# EAGLE schematic 7 Key Prototype (EAGLE 9.6.2)
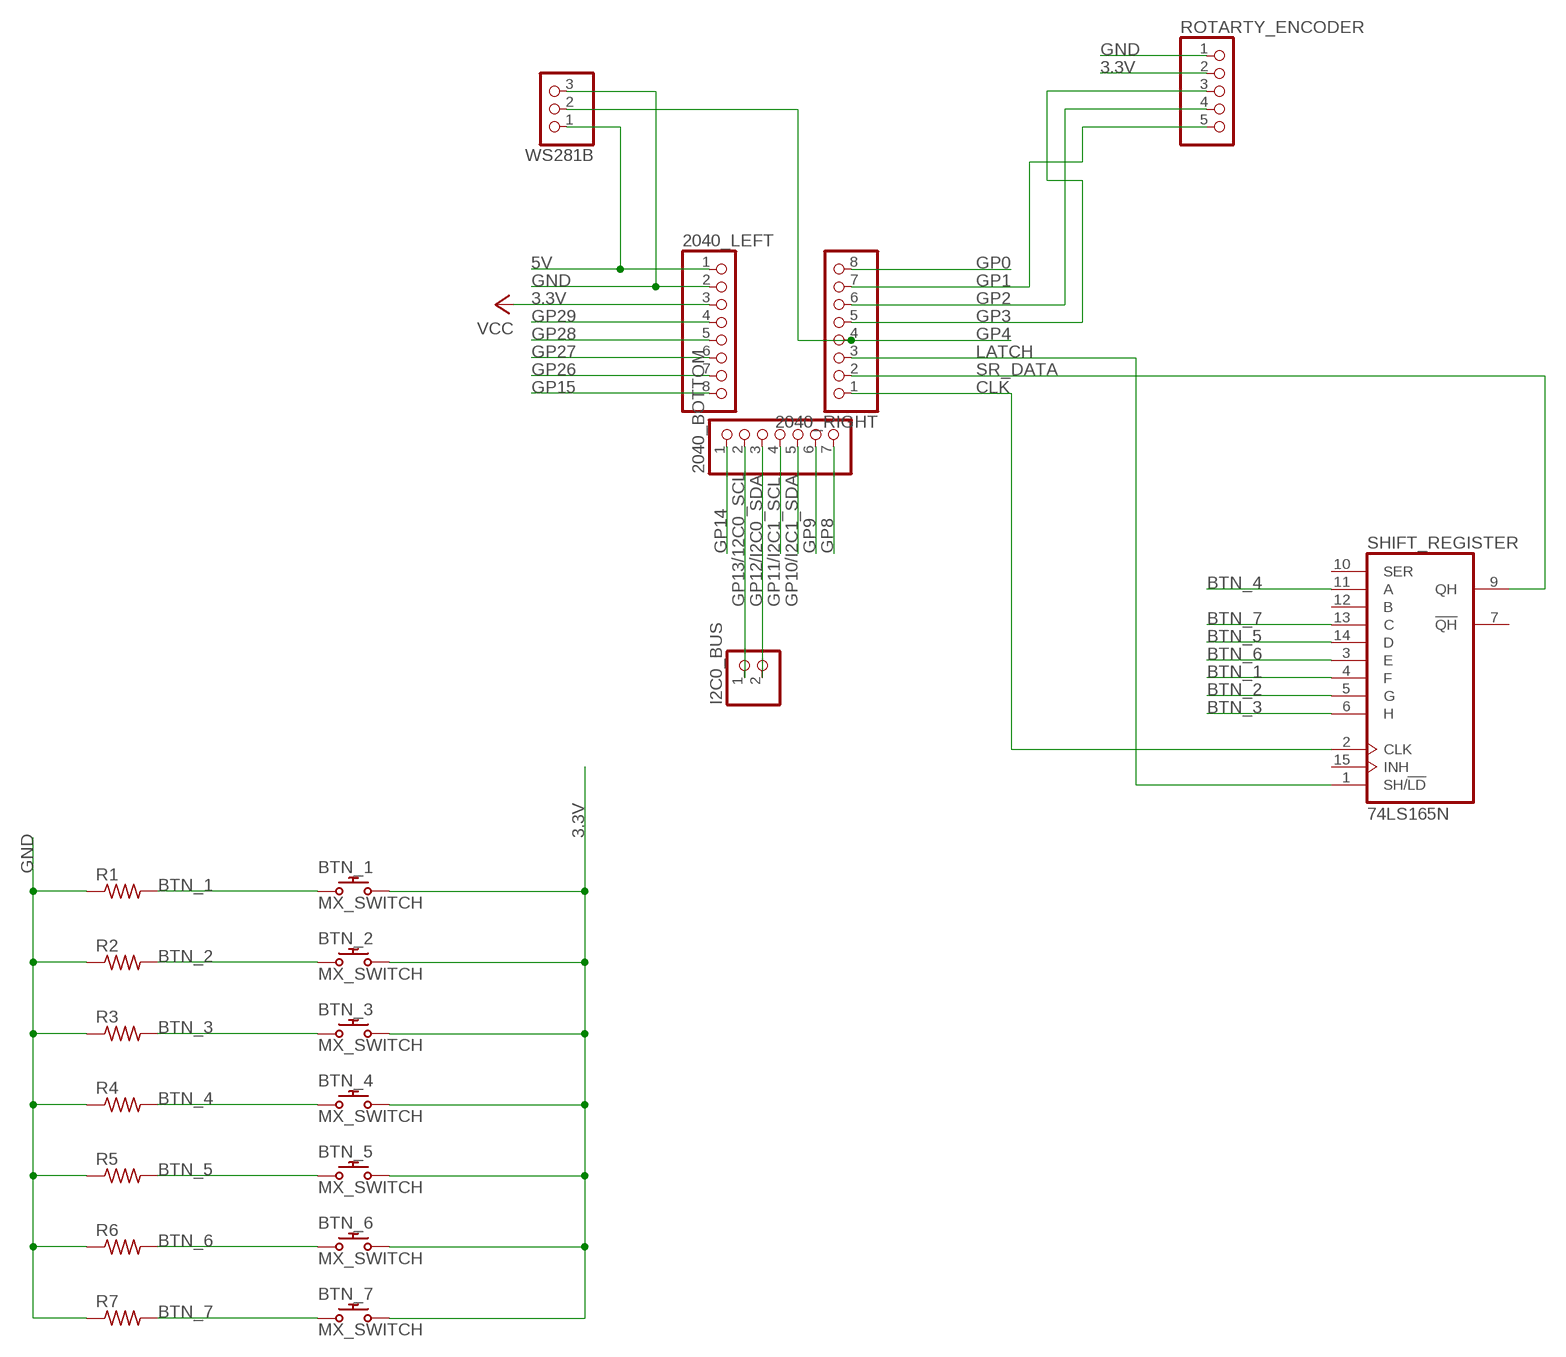
[diagram p0: schematic, sheet 1]

## Parts
2040_BOTTOM  PINHD-1X7  [1X07]
2040_LEFT  PINHD-1X8  [1X08]
2040_RIGHT  PINHD-1X8  [1X08]
BTN_1  MX_SWITCH  [MX_SWITCH]
BTN_2  MX_SWITCH  [MX_SWITCH]
BTN_3  MX_SWITCH  [MX_SWITCH]
BTN_4  MX_SWITCH  [MX_SWITCH]
BTN_5  MX_SWITCH  [MX_SWITCH]
BTN_6  MX_SWITCH  [MX_SWITCH]
BTN_7  MX_SWITCH  [MX_SWITCH]
I2C0_BUS  PINHD-1X2  [1X02]
R1  ADAFRUIT_R-US_R0805  [ADAFRUIT_R0805]
R2  ADAFRUIT_R-US_R0805  [ADAFRUIT_R0805]
R3  ADAFRUIT_R-US_R0805  [ADAFRUIT_R0805]
R4  ADAFRUIT_R-US_R0805  [ADAFRUIT_R0805]
R5  ADAFRUIT_R-US_R0805  [ADAFRUIT_R0805]
R6  ADAFRUIT_R-US_R0805  [ADAFRUIT_R0805]
R7  ADAFRUIT_R-US_R0805  [ADAFRUIT_R0805]
ROTARTY_ENCODER  PINHD-1X5  [1X05]
SHIFT_REGISTER  74LS165N  [DIL16]
WS281B  PINHD-1X3  [1X03]

## Nets
3.3V: 2040_LEFT.3 BTN_1.S2 BTN_2.S2 BTN_3.S2 BTN_4.S2 BTN_5.S2 BTN_6.S2 BTN_7.S2 ROTARTY_ENCODER.2 ; supply symbol labelled VCC
5V: 2040_LEFT.1 WS281B.1
BTN_1: BTN_1.S1 R1.2 SHIFT_REGISTER.4(F)
BTN_2: BTN_2.S1 R2.2 SHIFT_REGISTER.5(G)
BTN_3: BTN_3.S1 R3.2 SHIFT_REGISTER.6(H)
BTN_4: BTN_4.S1 R4.2 SHIFT_REGISTER.11(A)
BTN_5: BTN_5.S1 R5.2 SHIFT_REGISTER.14(D)
BTN_6: BTN_6.S1 R6.2 SHIFT_REGISTER.3(E)
BTN_7: BTN_7.S1 R7.2 SHIFT_REGISTER.13(C)
CLK: 2040_RIGHT.1 SHIFT_REGISTER.2(CLK)
GND: 2040_LEFT.2 R1.1 R2.1 R3.1 R4.1 R5.1 R6.1 R7.1 ROTARTY_ENCODER.1 WS281B.3
GP0: 2040_RIGHT.8
GP1: 2040_RIGHT.7 ROTARTY_ENCODER.5
GP2: 2040_RIGHT.6 ROTARTY_ENCODER.4
GP3: 2040_RIGHT.5 ROTARTY_ENCODER.3
GP4: 2040_RIGHT.4 WS281B.2
GP8: 2040_BOTTOM.7
GP9: 2040_BOTTOM.6
GP10/I2C1_SDA: 2040_BOTTOM.5
GP11/I2C1_SCL: 2040_BOTTOM.4
GP12/I2C0_SDA: 2040_BOTTOM.3 I2C0_BUS.2
GP13/12C0_SCL: 2040_BOTTOM.2 I2C0_BUS.1
GP14: 2040_BOTTOM.1
GP15: 2040_LEFT.8
GP26: 2040_LEFT.7
GP27: 2040_LEFT.6
GP28: 2040_LEFT.5
GP29: 2040_LEFT.4
LATCH: 2040_RIGHT.3 SHIFT_REGISTER.1(SH/!LD)
SR_DATA: 2040_RIGHT.2 SHIFT_REGISTER.9(QH)
Unconnected: SHIFT_REGISTER.7(!QH) SHIFT_REGISTER.10(SER) SHIFT_REGISTER.12(B) SHIFT_REGISTER.15(INH)

## Power pins joined to a net without a drawn wire
GND: SHIFT_REGISTER.8(GND)
VCC: SHIFT_REGISTER.16(VCC)

## Library data of the parts
2040_BOTTOM = pinhead:PINHD-1X7: PIN HEADER
2040_LEFT 2040_RIGHT = pinhead:PINHD-1X8: PIN HEADER
BTN_1-BTN_7 = MX_Switch:MX_SWITCH: Cherry keymodule MX; FARNELL: 2292961; MOUSER: 540-MX1A-11NW
I2C0_BUS = pinhead:PINHD-1X2: PIN HEADER
R1-R7 = Ocreeb 12:ADAFRUIT_R-US_: RESISTOR, American symbol
ROTARTY_ENCODER = pinhead:PINHD-1X5: PIN HEADER
SHIFT_REGISTER = 74xx-us:74*165: 8-bit parallel load SHIFT REGISTER
WS281B = pinhead:PINHD-1X3: PIN HEADER